# EAGLE design car4x4 (EAGLE 5.12)

## Sheet 1 of 3
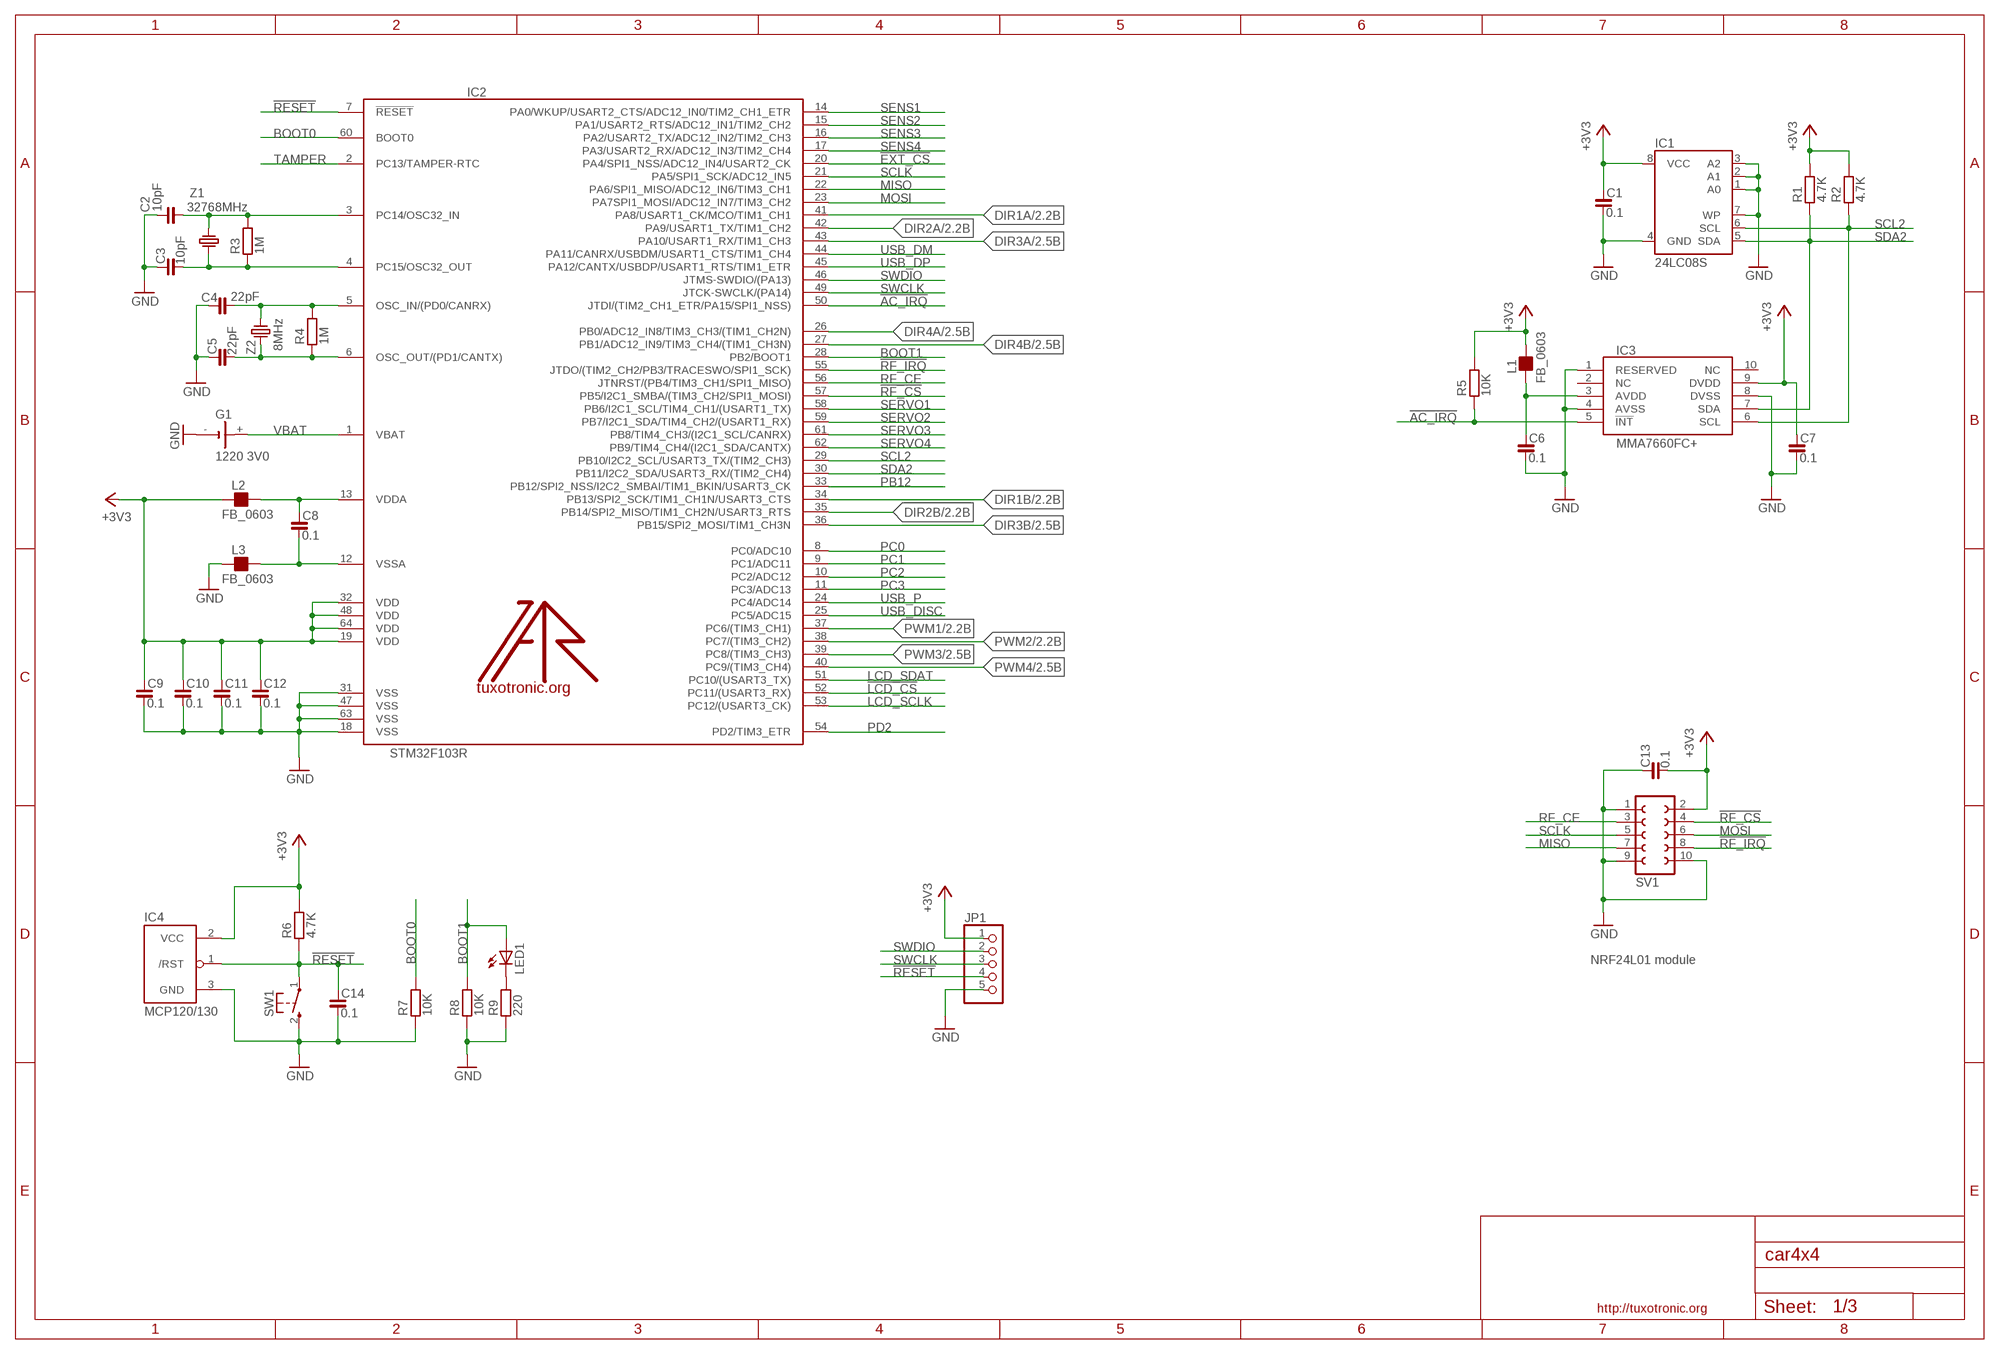
[diagram p0: schematic, sheet 1]

### Parts
C1  0.1  C_0603  [C0603]
C2  10pF  C_0603  [C0603]
C3  10pF  C_0603  [C0603]
C4  22pF  C_0603  [C0603]
C5  22pF  C_0603  [C0603]
C6  0.1  C_0603  [C0603]
C7  0.1  C_0603  [C0603]
C8  0.1  C_0603  [C0603]
C9  0.1  C_0603  [C0603]
C10  0.1  C_0603  [C0603]
C11  0.1  C_0603  [C0603]
C12  0.1  C_0603  [C0603]
C13  0.1  C_0603  [C0603]
C14  0.1  C_0603  [C0603]
G1  1220 3V0  1220SMT  [SMT1220]
IC1  24LC08S  AT24C256S  [SO08]
IC2  STM32F103R  [TQFP64]
IC3  MMA7660FC+  [DFN10]
IC4  MCP120/130  [SOT23]
JP1  PINHD-1X5_2.00  [1X05M]
L1  FB_0603  [L0603]
L2  FB_0603  [L0603]
L3  FB_0603  [L0603]
LED1  LEDCHIPLED_0805  [CHIPLED_0805]
R1  4.7K  R_0603  [R0603]
R2  4.7K  R_0603  [R0603]
R3  1M  R_0603  [R0603]
R4  1M  R_0603  [R0603]
R5  10K  R_0603  [R0603]
R6  4.7K  R_0603  [R0603]
R7  10K  R_0603  [R0603]
R8  10K  R_0603  [R0603]
R9  220  R_0603  [R0603]
SV1  FE05-2  [FE05-2]
SW1  KSS-2EG4430  [KSS-2EG4430]
U$1  LOGO  [TT_LOGO]
Z1  32768MHz  CRYSTAL-TC26H  [TC26H]
Z2  8MHz  CRYSTAL-HC49S  [HC49/S]

### Nets
!AC_IRQ: IC2.50(JTDI/(TIM2_CH1_ETR/PA15/SPI1_NSS)) IC3.5(!INT) R5.1
!EXT_CS: IC2.20(PA4/SPI1_NSS/ADC12_IN4/USART2_CK) ; also sheet 3
!LCD_CS: IC2.52(PC11/(USART3_RX)) ; also sheet 3
!RESET: C14.1 IC2.7(!RESET) IC4.1(/RST) JP1.4 R6.1 SW1.1(P) ; also sheet 3
!RF_CS: IC2.57(PB5/I2C1_SMBA/(TIM3_CH2/SPI1_MOSI)) SV1.4 ; also sheet 3
!RF_IRQ: IC2.55(JTDO/(TIM2_CH2/PB3/TRACESWO/SPI1_SCK)) SV1.8 ; also sheet 3
+3V3: C1.1 C7.1 C9.1 C10.1 C11.1 C12.1 C13.2 IC1.8(VCC) IC2.19(VDD) IC2.32(VDD) IC2.48(VDD) IC2.64(VDD) IC3.9(DVDD) IC4.2(VCC) JP1.1 L1.2 L2.1 R1.2 R2.2 R5.2 R6.2 SV1.2 ; also sheet 3
BOOT0: IC2.60(BOOT0) R7.2
BOOT1: IC2.28(PB2/BOOT1) LED1.A R8.2
DIR1A: IC2.41(PA8/USART1_CK/MCO/TIM1_CH1) ; also sheet 2
DIR1B: IC2.34(PB13/SPI2_SCK/TIM1_CH1N/USART3_CTS) ; also sheet 2
DIR2A: IC2.42(PA9/USART1_TX/TIM1_CH2) ; also sheet 2
DIR2B: IC2.35(PB14/SPI2_MISO/TIM1_CH2N/USART3_RTS) ; also sheet 2
DIR3A: IC2.43(PA10/USART1_RX/TIM1_CH3) ; also sheet 2
DIR3B: IC2.36(PB15/SPI2_MOSI/TIM1_CH3N) ; also sheet 2
DIR4A: IC2.26(PB0/ADC12_IN8/TIM3_CH3/(TIM1_CH2N)) ; also sheet 2
DIR4B: IC2.27(PB1/ADC12_IN9/TIM3_CH4/(TIM1_CH3N)) ; also sheet 2
GND: C1.2 C2.1 C3.1 C4.1 C5.1 C6.2 C7.2 C9.2 C10.2 C11.2 C12.2 C13.1 C14.2 G1.- IC1.1(A0) IC1.2(A1) IC1.3(A2) IC1.4(GND) IC1.7(WP) IC2.18(VSS) IC2.31(VSS) IC2.47(VSS) IC2.63(VSS) IC3.1(RESERVED) IC3.4(AVSS) IC3.8(DVSS) IC4.3(GND) JP1.5 L3.1 R7.1 R8.1 R9.1 SV1.1 SV1.9 SV1.10 SW1.2(S) ; also sheet 2,3
LCD_SCLK: IC2.53(PC12/(USART3_CK)) ; also sheet 3
LCD_SDAT: IC2.51(PC10/(USART3_TX)) ; also sheet 3
MISO: IC2.22(PA6/SPI1_MISO/ADC12_IN6/TIM3_CH1) SV1.7 ; also sheet 3
MOSI: IC2.23(PA7SPI1_MOSI/ADC12_IN7/TIM3_CH2) SV1.6 ; also sheet 3
N$4: C3.2 IC2.4(PC15/OSC32_OUT) R3.1 Z1.1
N$5: C2.2 IC2.3(PC14/OSC32_IN) R3.2 Z1.2
N$7: C8.1 IC2.13(VDDA) L2.2
N$16: C4.2 IC2.5(OSC_IN/(PD0/CANRX)) R4.2 Z2.2
N$21: LED1.C R9.2
N$22: C8.2 IC2.12(VSSA) L3.2
N$23: C6.1 IC3.3(AVDD) L1.1
PB12: IC2.33(PB12/SPI2_NSS/I2C2_SMBAI/TIM1_BKIN/USART3_CK) ; also sheet 3
PC0: IC2.8(PC0/ADC10) ; also sheet 3
PC1: IC2.9(PC1/ADC11) ; also sheet 3
PC2: IC2.10(PC2/ADC12) ; also sheet 3
PC3: IC2.11(PC3/ADC13) ; also sheet 3
PD2: IC2.54(PD2/TIM3_ETR) ; also sheet 3
PWM1: IC2.37(PC6/(TIM3_CH1)) ; also sheet 2
PWM2: IC2.38(PC7/(TIM3_CH2)) ; also sheet 2
PWM3: IC2.39(PC8/(TIM3_CH3)) ; also sheet 2
PWM4: IC2.40(PC9/(TIM3_CH4)) ; also sheet 2
RF_CE: IC2.56(JTNRST/(PB4/TIM3_CH1/SPI1_MISO)) SV1.3 ; also sheet 3
SCL2: IC1.6(SCL) IC2.29(PB10/I2C2_SCL/USART3_TX/(TIM2_CH3)) IC3.6(SCL) R2.1 ; also sheet 3
SCLK: IC2.21(PA5/SPI1_SCK/ADC12_IN5) SV1.5 ; also sheet 3
SDA2: IC1.5(SDA) IC2.30(PB11/I2C2_SDA/USART3_RX/(TIM2_CH4)) IC3.7(SDA) R1.1 ; also sheet 3
SENS1: IC2.14(PA0/WKUP/USART2_CTS/ADC12_IN0/TIM2_CH1_ETR) ; also sheet 3
SENS2: IC2.15(PA1/USART2_RTS/ADC12_IN1/TIM2_CH2) ; also sheet 3
SENS3: IC2.16(PA2/USART2_TX/ADC12_IN2/TIM2_CH3) ; also sheet 3
SENS4: IC2.17(PA3/USART2_RX/ADC12_IN3/TIM2_CH4) ; also sheet 3
SERVO1: IC2.58(PB6/I2C1_SCL/TIM4_CH1/(USART1_TX)) ; also sheet 3
SERVO2: IC2.59(PB7/I2C1_SDA/TIM4_CH2/(USART1_RX)) ; also sheet 3
SERVO3: IC2.61(PB8/TIM4_CH3/(I2C1_SCL/CANRX)) ; also sheet 3
SERVO4: IC2.62(PB9/TIM4_CH4/(I2C1_SDA/CANTX)) ; also sheet 3
SWCLK: IC2.49(JTCK-SWCLK/(PA14)) JP1.3
SWDIO: IC2.46(JTMS-SWDIO/(PA13)) JP1.2
TAMPER: IC2.2(PC13/TAMPER-RTC) ; also sheet 3
USB_DISC: IC2.25(PC5/ADC15) ; also sheet 3
USB_DM: IC2.44(PA11/CANRX/USBDM/USART1_CTS/TIM1_CH4) ; also sheet 3
USB_DP: IC2.45(PA12/CANTX/USBDP/USART1_RTS/TIM1_ETR) ; also sheet 3
USB_P: IC2.24(PC4/ADC14) ; also sheet 3
VBAT: G1.+ IC2.1(VBAT)
XTAL2: C5.2 IC2.6(OSC_OUT/(PD1/CANTX)) R4.1 Z2.1
Unconnected: IC3.2(NC) IC3.10(NC)

### Notes on the sheet
- NRF24L01 module

## Sheet 2 of 3
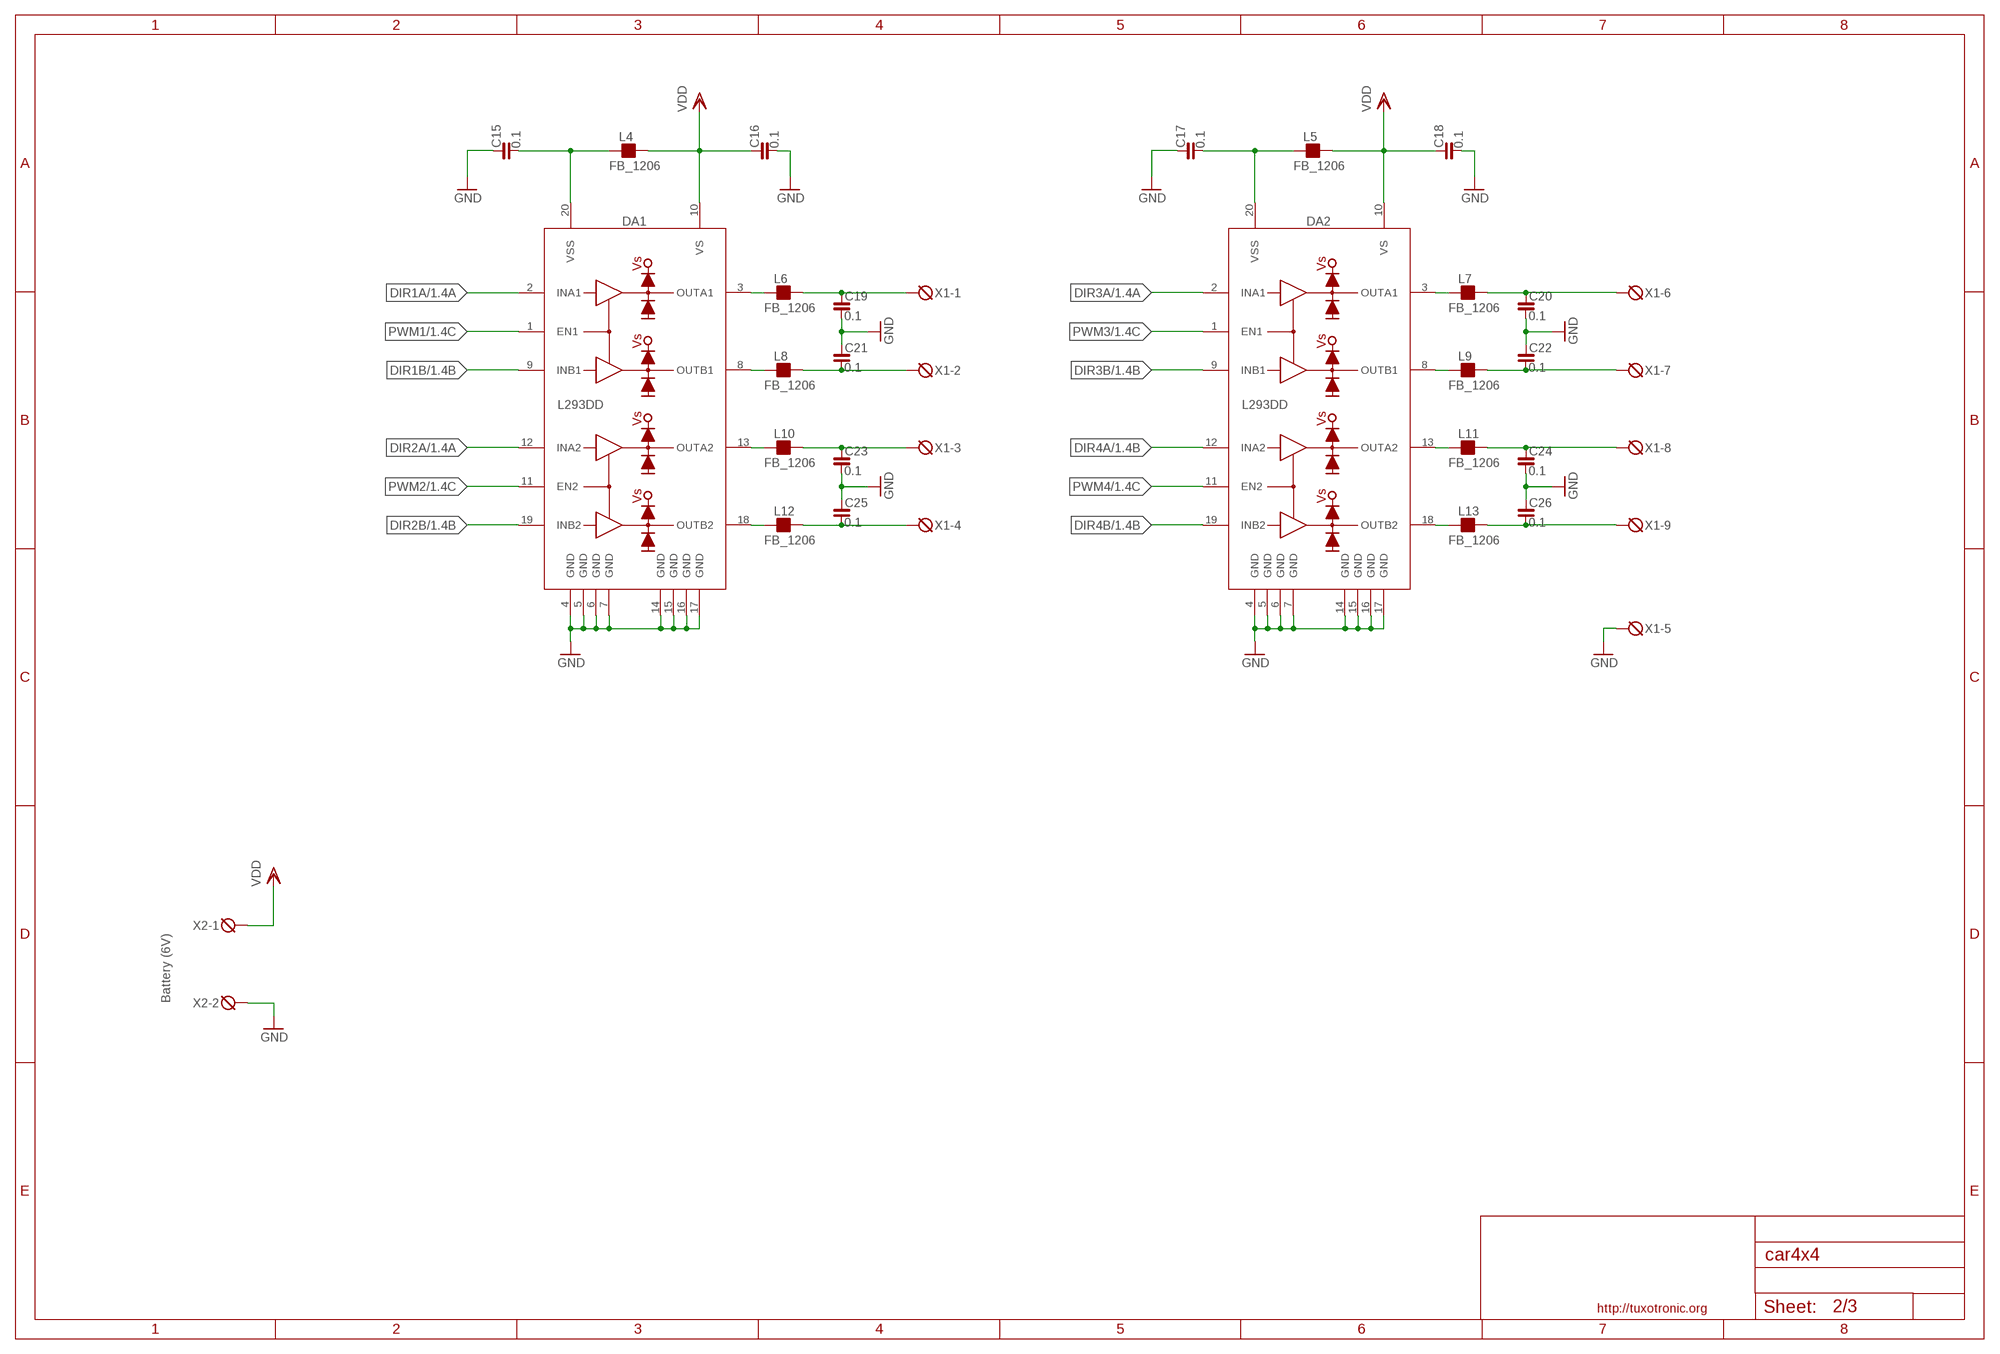
[diagram p1: schematic, sheet 2]

### Parts
C15  0.1  C_0603  [C0603]
C16  0.1  C_0603  [C0603]
C17  0.1  C_0603  [C0603]
C18  0.1  C_0603  [C0603]
C19  0.1  C_1206  [C1206]
C20  0.1  C_1206  [C1206]
C21  0.1  C_1206  [C1206]
C22  0.1  C_1206  [C1206]
C23  0.1  C_1206  [C1206]
C24  0.1  C_1206  [C1206]
C25  0.1  C_1206  [C1206]
C26  0.1  C_1206  [C1206]
DA1  L293DD  [POW-SO20L]
DA2  L293DD  [POW-SO20L]
L4  FB_1206  [L1206]
L5  FB_1206  [L1206]
L6  FB_1206  [L1206]
L7  FB_1206  [L1206]
L8  FB_1206  [L1206]
L9  FB_1206  [L1206]
L10  FB_1206  [L1206]
L11  FB_1206  [L1206]
L12  FB_1206  [L1206]
L13  FB_1206  [L1206]
X1  DG3XX-09-3.5  [DG350-3.5-09P]
X2  DG3XX-02-5.0  [DG306-5.0-02P]

### Nets
DIR1A: DA1.2(INA1) ; also sheet 1
DIR1B: DA1.9(INB1) ; also sheet 1
DIR2A: DA1.12(INA2) ; also sheet 1
DIR2B: DA1.19(INB2) ; also sheet 1
DIR3A: DA2.2(INA1) ; also sheet 1
DIR3B: DA2.9(INB1) ; also sheet 1
DIR4A: DA2.12(INA2) ; also sheet 1
DIR4B: DA2.19(INB2) ; also sheet 1
GND: C15.1 C16.2 C17.1 C18.2 C19.2 C20.2 C21.1 C22.1 C23.2 C24.2 C25.1 C26.1 DA1.4(GND) DA1.5(GND) DA1.6(GND) DA1.7(GND) DA1.14(GND) DA1.15(GND) DA1.16(GND) DA1.17(GND) DA2.4(GND) DA2.5(GND) DA2.6(GND) DA2.7(GND) DA2.14(GND) DA2.15(GND) DA2.16(GND) DA2.17(GND) X1.5 X2.2 ; also sheet 1,3
N$10: C15.2 DA1.20(VSS) L4.1
N$11: DA1.3(OUTA1) L6.1
N$12: DA1.8(OUTB1) L8.1
N$13: DA1.13(OUTA2) L10.1
N$14: DA1.18(OUTB2) L12.1
N$15: C17.2 DA2.20(VSS) L5.1
N$17: DA2.3(OUTA1) L7.1
N$18: DA2.8(OUTB1) L9.1
N$19: DA2.13(OUTA2) L11.1
N$20: DA2.18(OUTB2) L13.1
N$28: C19.1 L6.2 X1.1
N$29: C21.2 L8.2 X1.2
N$30: C23.1 L10.2 X1.3
N$31: C25.2 L12.2 X1.4
N$32: C20.1 L7.2 X1.6
N$33: C22.2 L9.2 X1.7
N$34: C24.1 L11.2 X1.8
N$35: C26.2 L13.2 X1.9
PWM1: DA1.1(EN1) ; also sheet 1
PWM2: DA1.11(EN2) ; also sheet 1
PWM3: DA2.1(EN1) ; also sheet 1
PWM4: DA2.11(EN2) ; also sheet 1
VDD: C16.1 C18.1 DA1.10(VS) DA2.10(VS) L4.2 L5.2 X2.1 ; also sheet 3

### Notes on the sheet
- Battery (6V)

## Sheet 3 of 3
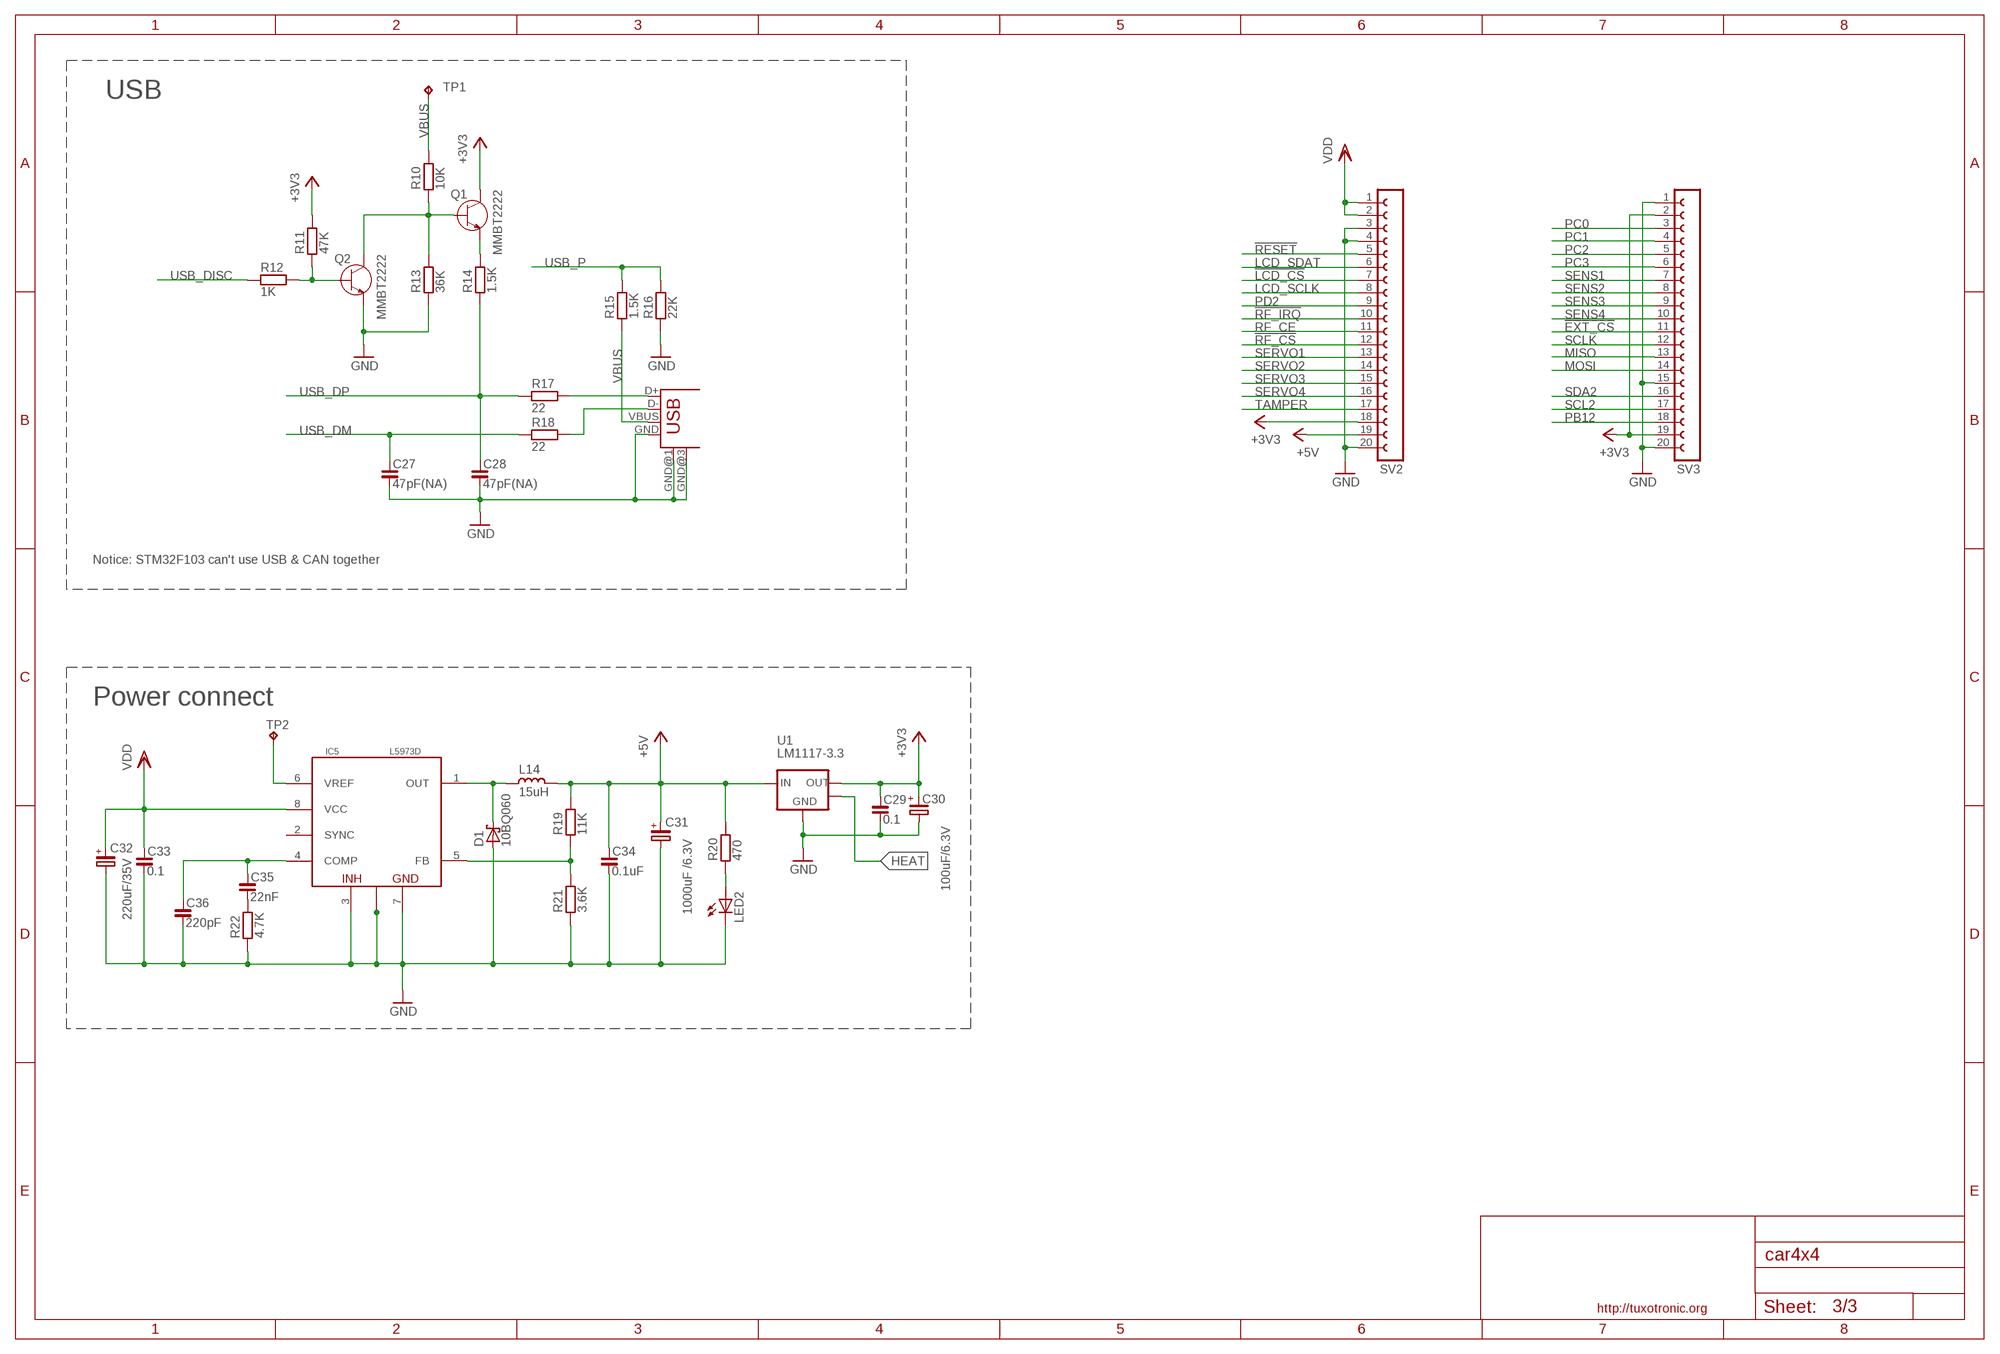
[diagram p2: schematic, sheet 3]

### Parts
C27  47pF(NA)  C_0603  [C0603]
C28  47pF(NA)  C_0603  [C0603]
C29  0.1  C_0603  [C0603]
C30  100uF/6.3V  CP_SMCC  [SMC_C]
C31  1000uF /6.3V  CP_E-035X080  [CE-035X080]
C32  220uF/35V  CP_E-035X080  [CE-035X080]
C33  0.1  C_0805  [C0805]
C34  0.1uF  C_0805  [C0805]
C35  22nF  C_0603  [C0603]
C36  220pF  C_0603  [C0603]
D1  10BQ060  SCHOTTKY-DIODESMD  [SMB]
IC5  L5973D  [HSOP8]
L14  15uH  L_CD75  [CD75]
LED2  LEDCHIPLED_0805  [CHIPLED_0805]
Q1  MMBT2222  [SOT23]
Q2  MMBT2222  [SOT23]
R10  10K  R_0603  [R0603]
R11  47K  R_0603  [R0603]
R12  1K  R_0603  [R0603]
R13  36K  R_0603  [R0603]
R14  1.5K  R_0603  [R0603]
R15  1.5K  R_0603  [R0603]
R16  22K  R_0603  [R0603]
R17  22  R_0603  [R0603]
R18  22  R_0603  [R0603]
R19  11K  R_0603  [R0603]
R20  470  R_0603  [R0603]
R21  3.6K  R_0603  [R0603]
R22  4.7K  R_0603  [R0603]
SV2  FE20-1  [FE20]
SV3  FE20-1  [FE20]
TP1  TPB1,27  [B1,27]
TP2  TPB1,27  [B1,27]
U1  LM1117-3.3  [SOT223]
USB1  USB-MB-S  [USB-MB-S]

### Nets
!EXT_CS: SV3.11 ; also sheet 1
!LCD_CS: SV2.7 ; also sheet 1
!RESET: SV2.5 ; also sheet 1
!RF_CS: SV2.12 ; also sheet 1
!RF_IRQ: SV2.10 ; also sheet 1
+3V3: C29.1 C30.+ Q1.3(C) R11.2 SV2.18 SV3.2 SV3.19 U1.2(OUT) ; also sheet 1
+5V: C31.+ C34.1 L14.1 R19.2 R20.2 SV2.19 U1.3(IN)
GND: C27.2 C28.2 C29.2 C30.- C31.- C32.- C33.2 C34.2 C36.2 D1.A IC5.3(INH) IC5.7(GND) IC5.H@1(GND1) IC5.H@2(GND2) IC5.H@3(GND3) IC5.H@4(GND4) IC5.H@5(GND5) IC5.H@6(GND6) LED2.C Q2.2(E) R13.1 R16.1 R21.1 R22.1 SV2.3 SV2.4 SV2.20 SV3.1 SV3.15 SV3.20 U1.1(GND) USB1.GND USB1.GND@1(GND) USB1.GND@3(GND) ; also sheet 1,2
HEAT: U1.4(MASS)
LCD_SCLK: SV2.8 ; also sheet 1
LCD_SDAT: SV2.6 ; also sheet 1
MISO: SV3.13 ; also sheet 1
MOSI: SV3.14 ; also sheet 1
N$36: Q1.2(E) R14.2
N$37: Q1.1(B) Q2.3(C) R10.1 R13.2
N$38: Q2.1(B) R11.1 R12.2
N$39: R17.2 USB1.D+
N$40: R18.2 USB1.D-
N$41: D1.C IC5.1(OUT) L14.2
N$42: IC5.5(FB) R19.1 R21.2
N$43: C35.2 R22.2
N$44: C35.1 C36.1 IC5.4(COMP)
N$45: IC5.6(VREF) TP2.PP(TP)
N$46: LED2.A R20.1
PB12: SV3.18 ; also sheet 1
PC0: SV3.3 ; also sheet 1
PC1: SV3.4 ; also sheet 1
PC2: SV3.5 ; also sheet 1
PC3: SV3.6 ; also sheet 1
PD2: SV2.9 ; also sheet 1
RF_CE: SV2.11 ; also sheet 1
SCL2: SV3.17 ; also sheet 1
SCLK: SV3.12 ; also sheet 1
SDA2: SV3.16 ; also sheet 1
SENS1: SV3.7 ; also sheet 1
SENS2: SV3.8 ; also sheet 1
SENS3: SV3.9 ; also sheet 1
SENS4: SV3.10 ; also sheet 1
SERVO1: SV2.13 ; also sheet 1
SERVO2: SV2.14 ; also sheet 1
SERVO3: SV2.15 ; also sheet 1
SERVO4: SV2.16 ; also sheet 1
TAMPER: SV2.17 ; also sheet 1
USB_DISC: R12.1 ; also sheet 1
USB_DM: C27.1 R18.1 ; also sheet 1
USB_DP: C28.1 R14.1 R17.1 ; also sheet 1
USB_P: R15.2 R16.2 ; also sheet 1
VBUS: R10.2 R15.1 TP1.PP(TP) USB1.VBUS
VDD: C32.+ C33.1 IC5.8(VCC) SV2.1 SV2.2 ; also sheet 2
Unconnected: IC5.2(SYNC)

### Notes on the sheet
- USB
- Notice: STM32F103 can't use USB & CAN together
- Power connect

## Library data of the parts
C1-C29 C33-C36 = rc-master-smd:C_: NON-POLARIZED CAP
C30 = rc-master-smd:CP_: POLARIZED CAP
C31 C32 = rc-master:CP_: POLARIZED CAP
D1 = main:SCHOTTKY-DIODE: Schottky Diode
DA1 DA2 = h-bridge:L293DD: Push-pull four channel driver with diodes.
G1 = battery:1220SMT
IC1 = stm32-by-pb:AT24C*: 2-wire serial EEPROM
IC2 = stm32:STM32F103R: Medium-density performance line ARM-based 32-bit MCU with 64 or 128 KB Flash, USB, CAN, 7 timers, 2 ADCs, 9 communication interfaces
IC3 = accelerometer:MMA7660FC: 3-Axis Orientation/Motion Detection Sensor Features Digital Output (I2C) 3mm x 3mm x 0.9mm DFN Package Low Power Current Consumption: Off Mode: 0.4 ?A, Standby Mode: 2 ?A, Active Mode: 47 ?A at 1 ODR Configurable Samples per Second from 1 to 120 samples a second. Low Voltage Operation: ? Analog Voltage: 2.4 V - 3.6 V ? Digital Voltage: 1.71 V - 3.6 V Auto-Wake/Sleep Feature for Low Power Consumption Tilt Orientation Detection for Portrait/Landscape Capability Gesture Detection Including Shake Detection and Tap
IC4 = mcp120-130:MCP120/130
IC5 = vreg-pulse:L5973: 2A SWITCH STEP DOWN SWITCHING REGULATOR
JP1 = pinhead-fixdrills:PINHD-1X5: PIN HEADER
L1-L13 = rc-master-smd:FB_: FERRITE BEAD
L14 = rc-master-smd:L_: INDUCTOR
LED1 LED2 = led:LED: LED OSRAM: - CHIPLED LG R971, LG N971, LY N971, LG Q971, LY Q971, LO R971, LY R971 LH N974, LH R974 LS Q976, LO Q976, LY Q976 LO Q996 - Hyper CHIPLED LW Q18S LB Q993, LB Q99A, LB R99A - SideLED LS A670, LO A670, LY A670, LG A670, LP A670 LB A673, LV A673, LT A673, LW A673 LH A674 LY A675 LS A676, LA A676, LO A676, LY A676, LW A676 LS A679, LY A679, LG A679 - Hyper Micro SIDELED® LS Y876, LA Y876, LO Y876, LY Y876 LT Y87S - SmartLED LW L88C, LW L88S LB L89C, LB L89S, LG L890 LS L89K, LO L89K, LY L89K LS L896, LA L896, LO L896, LY L896 - TOPLED LS T670, LO T670, LY T670, LG T670, LP T670 LSG T670, LSP T670, LSY T670, LOP T670, LYG T670 LG T671, LOG T671, LSG T671 LB T673, LV T673, LT T673, LW T673 LH T674 LS T676, LA T676, LO T676, LY T676, LB T676, LH T676, LSB T676, LW T676 LB T67C, LV T67C, LT T67C, LS T67K, LO T67K, LY T67K, LW E67C LS E67B, LA E67B, LO E67B, LY E67B, LB E67C, LV E67C, LT E67C LW T67C LS T679, LY T679, LG T679 LS T770, LO T770, LY T770, LG T770, LP T770 LB T773, LV T773, LT T773, LW T773 LH T774 LS E675, LA E675, LY E675, LS T675 LS T776, LA T776, LO T776, LY T776, LB T776 LHGB T686 LT T68C, LB T68C - Hyper Mini TOPLED® LB M676 - Mini TOPLED Santana® LG M470 LS M47K, LO M47K, LY M47K Source: http://www.osram.convergy.de - LUMILED® LXK2-PW12-R00, LXK2-PW12-S00, LXK2-PW14-U00, LXK2-PW14-V00 LXK2-PM12-R00, LXK2-PM12-S00, LXK2-PM14-U00 LXK2-PE12-Q00, LXK2-PE12-R00, LXK2-PE12-S00, LXK2-PE14-T00, LXK2-PE14-U00 LXK2-PB12-K00, LXK2-PB12-L00, LXK2-PB12-M00, LXK2-PB14-N00, LXK2-PB14-P00, LXK2-PB14-Q00 LXK2-PR12-L00, LXK2-PR12-M00, LXK2-PR14-Q00, LXK2-PR14-R00 LXK2-PD12-Q00, LXK2-PD12-R00, LXK2-PD12-S00 LXK2-PH12-R00, LXK2-PH12-S00 LXK2-PL12-P00, LXK2-PL12-Q00, LXK2-PL12-R00 Source: www.luxeon.com
Q1 Q2 = semiconductor:MMBT2222: General Purpose Transistors NPN Silicon Rating MMBT2222LT1G MMBT2222ALT1G Collector-Emitter Voltage (VCEO) 30 Vdc 40 Vdc Collector-Base Voltage (VCBO) 60 Vdc 75 Vdc Emitter-Base Voltage (VEBO) 5.0 Vdc 6.0 Vdc Collector Current Continuous (IC) 600 mAdc 1100 mAdc Collector Current Peak (ICM) 600 mAdc 1100 mAdc
R1-R22 = rc-master-smd:R_: RESISTOR
SV1 = con-lsta:FE05-2: FEMALE HEADER
SV2 SV3 = con-lsta:FE20-1: FEMALE HEADER
SW1 = buttons:KSS-2EG4430: Size: 3x6mm Height: 5mm from PCB Rating: DC12v 50mA Travel: 0.25±0.10mm Operating Force: 180±50gf Return Force: 60gf min Contact resistance: 100m? max Insulation resistance: 100M? min Operating life?50,000 cycles
TP1 TP2 = testpad:TP: Test pad
U1 = vreg-linear:LM1117: Linear regulators
U$1 = logo:LOGO
USB1 = usb:USB: USB Connectors
X1 = degson:DG3XX-09: DG350-3.5-09P DG306-5.0-09P
X2 = degson:DG3XX-02: DG350-3.5-02P DG306-5.0-02P
Z1 Z2 = discrete:CRYSTAL-: CRYSTAL

## Board
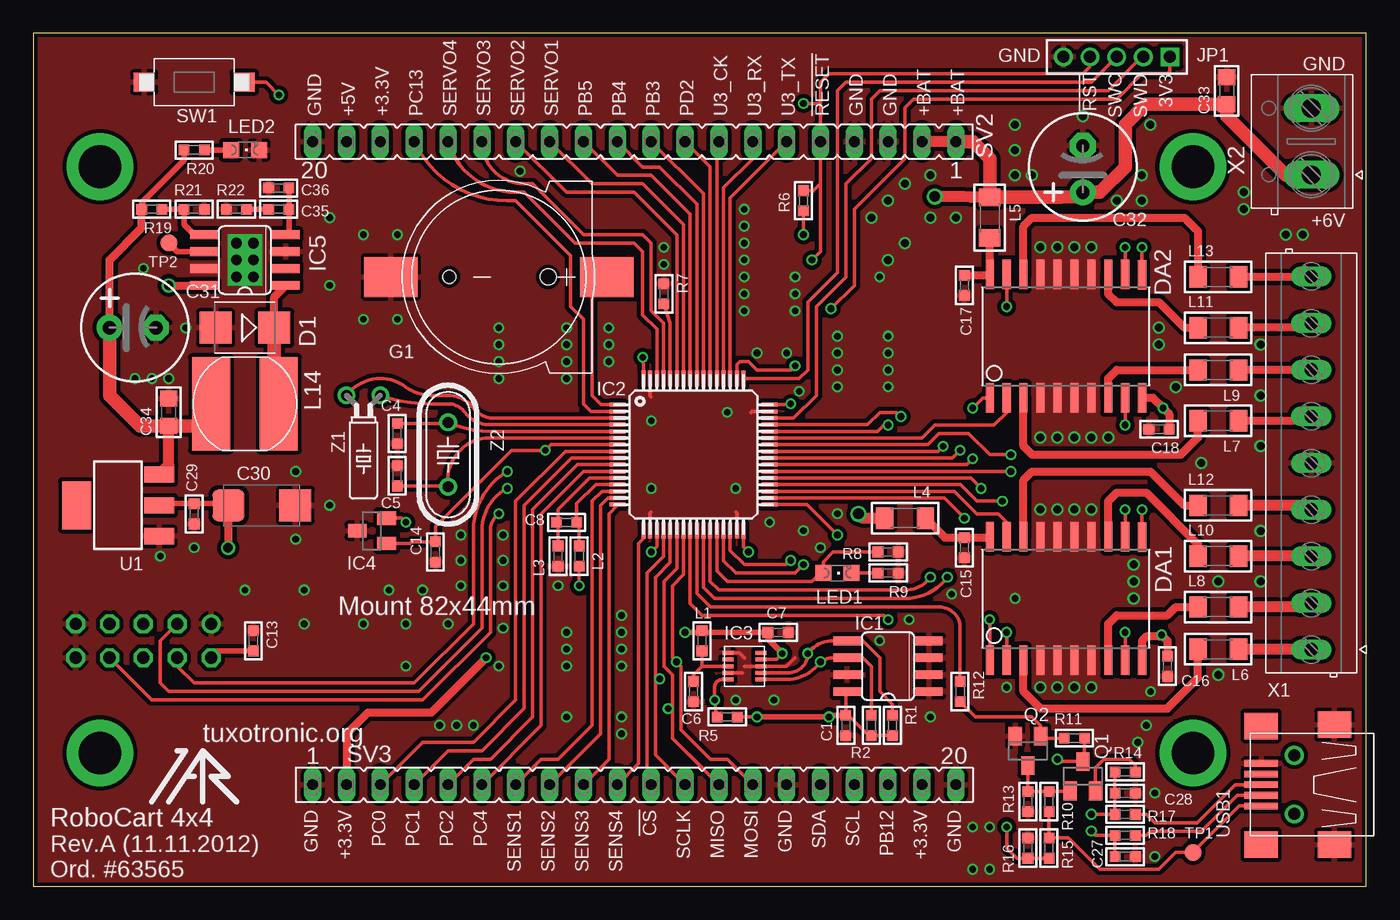
[diagram p3: board, top side]
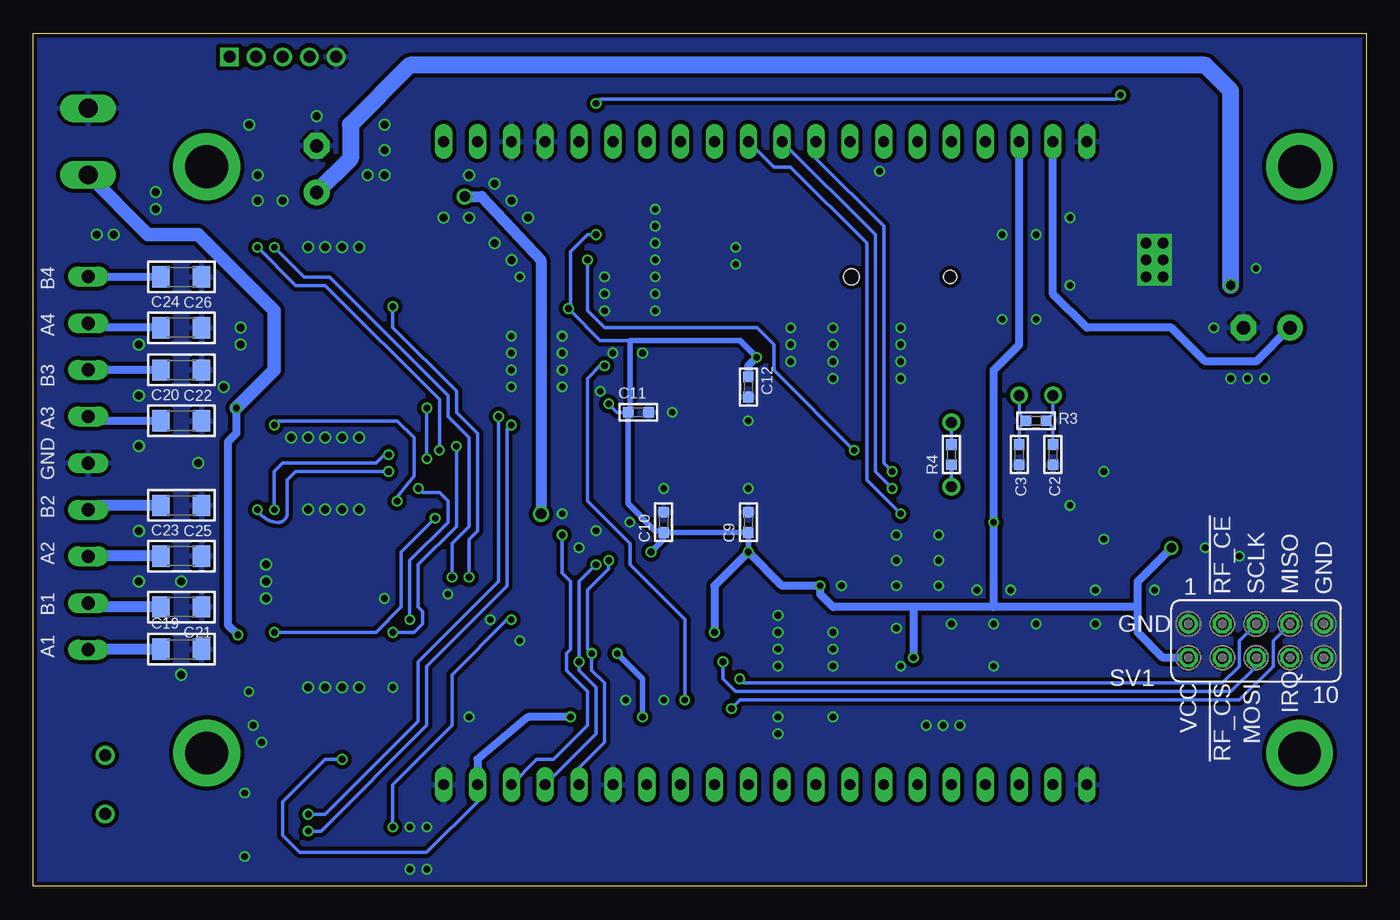
[diagram p4: board, bottom side, seen from below]

Size 100 x 64 mm. Coordinates in mm from the lower left corner, seen from the top.
Outline: 0,0 100,0 100,64 0,64 0,0
Copper layers (1*16): Top 0.035mm / dielectric 1.5mm / Bottom 0.035mm
Design rules "Fusion_eagle_rule_v1.1": minimum track width 6mil, minimum drill 12mil, track to track 6mil, track to pad 6mil, pad to pad 6mil, via to via 6mil, smd to smd 0mil, copper to edge 10mil, drill to drill 10mil, minimum pad ring 10mil, minimum via ring 6mil, stop-mask expansion 2mil, vias tented up to drill 100mil, thermal gap 10mil

### Footprints (pad centres in the part's own frame; a part is rotated, then mirrored left to right if it is on the bottom)
C0603 = smd 0.8 x 0.8: 1 -0.762,0; 2 0.762,0
C1206 = smd 1.3 x 1.6: 1 -1.524,0; 2 1.524,0
SMC_C = smd 2.4 x 2.4: + -2.5,0; - 2.5,0
CE-035X080 = drill 1 pad 1.93 round: + -1.905,0 | drill 1 pad 1.93 octagon: - 1.587,0
C0805 = smd 1.2 x 1.3: 1 -1.016,0; 2 1.016,0
SMB = smd 2.4 x 2.4: A 2.2,0; C -2.2,0
POW-SO20L = smd 0.61 x 2.21: 1 -5.715,-4.636; 2 -4.445,-4.636; 3 -3.175,-4.636; 4 -1.905,-4.636; 5 -0.635,-4.636; 6 0.635,-4.636; 7 1.905,-4.636; 8 3.175,-4.636; 9 4.445,-4.636; 10 5.715,-4.636; 11 5.715,4.61; 12 4.445,4.636; 13 3.175,4.636; 14 1.905,4.636; 15 0.635,4.636; 16 -0.635,4.636; 17 -1.905,4.636; 18 -3.175,4.636; 19 -4.445,4.636; 20 -5.715,4.636
SMT1220 = smd 4 x 3: + -8.1,0; - 8.1,0 | hole 1: 3.7,0 | hole 1.2: -3.7,0
SO08 = smd 0.66 x 2.032: 1 -1.905,-3.073; 2 -0.635,-3.073; 3 0.635,-3.073; 4 1.905,-3.073; 5 1.905,3.073; 6 0.635,3.073; 7 -0.635,3.073; 8 -1.905,3.073
TQFP64 = smd 1.2 x 0.3: 1 -5.7,3.75; 2 -5.7,3.25; 3 -5.7,2.75; 4 -5.7,2.25; 5 -5.7,1.75; 6 -5.7,1.25; 7 -5.7,0.75; 8 -5.7,0.25; 9 -5.7,-0.25; 10 -5.7,-0.75; 11 -5.7,-1.25; 12 -5.7,-1.75; 13 -5.7,-2.25; 14 -5.7,-2.75; 15 -5.7,-3.25; 16 -5.7,-3.75; 33 5.7,-3.75; 34 5.7,-3.25; 35 5.7,-2.75; 36 5.7,-2.25; 37 5.7,-1.75; 38 5.7,-1.25; 39 5.7,-0.75; 40 5.7,-0.25; 41 5.7,0.25; 42 5.7,0.75; 43 5.7,1.25; 44 5.7,1.75; 45 5.7,2.25; 46 5.7,2.75; 47 5.7,3.25; 48 5.7,3.75 | smd 0.3 x 1.2: 17 -3.75,-5.7; 18 -3.25,-5.7; 19 -2.75,-5.7; 20 -2.25,-5.7; 21 -1.75,-5.7; 22 -1.25,-5.7; 23 -0.75,-5.7; 24 -0.25,-5.7; 25 0.25,-5.7; 26 0.75,-5.7; 27 1.25,-5.7; 28 1.75,-5.7; 29 2.25,-5.7; 30 2.75,-5.7; 31 3.25,-5.7; 32 3.75,-5.7; 49 3.75,5.7; 50 3.25,5.7; 51 2.75,5.7; 52 2.25,5.7; 53 1.75,5.7; 54 1.25,5.7; 55 0.75,5.7; 56 0.25,5.7; 57 -0.25,5.7; 58 -0.75,5.7; 59 -1.25,5.7; 60 -1.75,5.7; 61 -2.25,5.7; 62 -2.75,5.7; 63 -3.25,5.7; 64 -3.75,5.7
DFN10 = smd 0.3 x 0.825: 1 -1,-1.24; 2 -0.5,-1.24; 3 0,-1.24; 4 0.5,-1.24; 5 1,-1.24; 6 1,1.24; 7 0.5,1.24; 8 0,1.24; 9 -0.5,1.24; 10 -1,1.24
SOT23 = smd 1 x 1.4: 1 -0.95,-1.1; 2 0.95,-1.1; 3 0,1.1
HSOP8 = smd 0.66 x 2.032: 1 -1.905,-3.073; 2 -0.635,-3.073; 3 0.635,-3.073; 4 1.905,-3.073; 5 1.905,3.073; 6 0.635,3.073; 7 -0.635,3.073; 8 -1.905,3.073 | drill 0.8 square: H@1 -1.27,-0.635; H@2 0,-0.635; H@3 1.27,-0.635; H@4 1.27,0.635; H@5 0,0.635; H@6 -1.27,0.635
1X05M = drill 0.9 square: 1 -4,0 | drill 0.9 round: 2 -2,0; 3 0,0; 4 2,0; 5 4,0
L0603 = smd 0.8 x 0.8: 1 -0.762,0; 2 0.762,0
L1206 = smd 1.3 x 1.6: 1 -1.524,0; 2 1.524,0
CD75 = smd 7 x 2.85: 1 0,2.54; 2 0,-2.54
CHIPLED_0805 = smd 1.2 x 1.2: A 0,-1.05; C 0,1.05
R0603 = smd 0.8 x 0.8: 1 -0.762,0; 2 0.762,0
FE05-2 = drill 0.914 round: 1 -5.08,1.27 | drill 0.914 octagon: 2 -5.08,-1.27; 3 -2.54,1.27; 4 -2.54,-1.27; 5 0,1.27; 6 0,-1.27; 7 2.54,1.27; 8 2.54,-1.27; 9 5.08,1.27; 10 5.08,-1.27
FE20 = drill 0.813 long: 1 -24.13,0; 2 -21.59,0; 3 -19.05,0; 4 -16.51,0; 5 -13.97,0; 6 -11.43,0; 7 -8.89,0; 8 -6.35,0; 9 -3.81,0; 10 -1.27,0; 11 1.27,0; 12 3.81,0; 13 6.35,0; 14 8.89,0; 15 11.43,0; 16 13.97,0; 17 16.51,0; 18 19.05,0; 19 21.59,0; 20 24.13,0
KSS-2EG4430 = smd 1.6 x 1.4: 1 -3.75,0; 2 3.75,0
B1,27 = smd 1.27 x 1.27: PP 0,0
SOT223 = smd 1.219 x 2.235: 1 -2.311,-3.099; 2 0,-3.099; 3 2.311,-3.099 | smd 3.6 x 2.2: 4 0,3.099
USB-MB-S = smd 2.5 x 0.5: D+ 2.5,0; D- 2.5,0.8; GND 2.5,-1.6; ID 2.5,-0.8; VBUS 2.5,1.6 | smd 2.5 x 2: GND@1 -3,4.5; GND@2 2.5,4.5; GND@3 -3,-4.5; GND@4 2.5,-4.4 | drill 0.9 round: P$5 0,2.2; P$6 0,-2.2
DG350-3.5-09P = drill 1 long: 1 -14,0; 2 -10.5,0; 3 -7,0; 4 -3.5,0; 5 0,0; 6 3.5,0; 7 7,0; 8 10.5,0; 9 14,0
DG306-5.0-02P = drill 1.4 long: 1 -2.5,0; 2 2.5,0
TC26H = drill 0.813 round: 1 -1.27,0; 2 1.27,0
HC49/S = drill 0.813 round: 1 -2.413,0; 2 2.413,0

### Placement (x,y rotation side)
C1  60.96,12.06 270 top
C2  23.5,32.38 90 bottom
C3  26.04,32.38 90 bottom
C4  27.3,33.97 90 top
C5  27.3,30.8 270 top
C6  49.53,14.61 270 top
C7  55.88,19.05 0 top
C8  40.01,27.3 180 top
C9  46.35,27.3 90 bottom
C10  52.7,27.3 90 bottom
C11  54.61,35.56 0 bottom
C12  46.35,37.47 270 bottom
C13  16.51,18.41 270 top
C14  30.16,25.08 270 top
C15  69.85,25.4 90 top
C16  85.09,16.51 270 top
C17  69.85,45.09 90 top
C18  84.45,34.29 180 top
C19  88.9,17.78 0 bottom
C20  88.9,34.92 0 bottom
C21  88.9,20.95 180 bottom
C22  88.9,38.73 180 bottom
C23  88.9,24.77 0 bottom
C24  88.9,41.91 0 bottom
C25  88.9,28.57 180 bottom
C26  88.9,45.72 180 bottom
C27  81.92,2.22 0 top
C28  81.92,6.99 0 top
C29  12.06,27.94 270 top
C30  17.14,28.57 0 top
C31  7.62,41.91 0 top
C32  78.74,53.98 90 top
C33  89.53,59.69 90 top
C34  10.16,35.56 90 top
C35  18.41,50.8 180 top
C36  18.41,52.39 180 top
D1  15.88,41.91 180 top
DA1  77.47,21.59 0 top
DA2  77.47,41.27 0 top
G1  34.92,45.72 180 top
IC1  64.14,16.51 90 top
IC2  49.53,32.38 0 top
IC3  53.34,16.51 270 top
IC4  25.4,26.67 90 top
IC5  15.88,46.99 90 top
JP1  81.28,62.23 180 top
L1  50.16,18.41 90 top
L2  40.96,24.77 90 top
L3  39.37,24.77 90 top
L4  65.41,27.62 180 top
L5  71.75,50.16 90 top
L6  88.9,17.78 0 top
L7  88.9,34.92 0 top
L8  88.9,20.95 0 top
L9  88.9,38.73 0 top
L10  88.9,24.77 0 top
L11  88.9,41.91 0 top
L12  88.9,28.57 0 top
L13  88.9,45.72 0 top
L14  15.88,36.2 90 top
LED1  60.33,23.5 270 top
LED2  15.88,55.24 270 top
Q1  78.74,8.26 0 top
Q2  74.61,10.16 180 top
R1  64.45,12.06 270 top
R2  62.87,12.06 270 top
R3  24.77,34.92 0 bottom
R4  31.11,32.38 90 bottom
R5  52.07,12.7 0 top
R6  57.78,51.44 270 top
R7  47.31,44.45 270 top
R8  64.14,25.08 180 top
R9  64.14,23.5 180 top
R10  76.2,6.35 270 top
R11  78.11,11.11 0 top
R12  69.53,14.61 270 top
R13  74.61,6.35 90 top
R14  81.92,8.57 0 top
R15  76.2,2.86 270 top
R16  74.61,2.86 270 top
R17  81.92,5.4 0 top
R18  81.92,3.81 0 top
R19  8.89,50.8 180 top
R20  12.06,55.24 180 top
R21  12.06,50.8 180 top
R22  15.24,50.8 0 top
SV1  8.26,18.41 0 bottom
SV2  45.09,55.88 180 top
SV3  45.09,7.62 0 top
SW1  12.06,60.33 180 top
TP1  87,2.54 0 top
TP2  10.16,48.26 180 top
U1  6.35,28.57 90 top
U$1  12.7,8.89 0 top
USB1  94.61,7.62 180 top
X1  95.89,31.75 90 top
X2  95.89,55.88 90 top
Z1  24.77,36.83 180 top
Z2  31.11,32.38 90 top

### Tracks (layer width: path | path; a pad name or v marks a point on that pad's centre or on a via)
!AC_IRQ  (via drill 0.5)
  Top 0.254: IC2.50 52.78,39.13 53.02,39.37 53.66,39.37 54.29,38.73 56.83,38.73 v57.15,39.05 | IC3.5 51.7,15.51 arc90 51.12,14.92 v51.12,13.97 arc17 R5.1
  Bottom 0.254: v57.15,39.05 57.47,39.05 58.42,38.1 58.42,28.89 55.24,25.72 55.24,24.13 51.12,20 v51.12,13.97
!EXT_CS
  Top 0.254: IC2.20 47.28,24.74 46.04,23.5 46.04,7.94 SV3.11
!LCD_CS
  Top 0.254: IC2.52 51.78,52.41 53.98,54.61 SV2.7
!RESET  (via drill 0.5)
  Top 0.254: 59.05,58.74 SV2.5 59.05,52.7 | IC2.7 38.85,33.13 v38.42,32.7 35.88,32.7 30.16,26.99 C14.1 28.38,25.84 28.26,25.72 IC4.1 | v58.42,46.99 59.05,47.62 59.05,52.7 | SW1.1 17.46,60.33 v18.41,59.37 | 59.05,58.74 v57.78,58.74 | JP1.4 79.28,61.5 78.74,60.96 59.69,60.96 59.05,60.33 59.05,58.74 | R6.1 58.55,52.2 59.05,52.7
  Bottom 0.254: v38.42,32.7 44.45,38.73 44.45,40.64 45.72,41.91 57.15,41.91 58.42,43.18 v58.42,46.99 | v18.41,59.37 18.73,59.05 57.47,59.05 v57.78,58.74
!RF_CS  (via drill 0.5)
  Top 0.254: IC2.57 49.28,50.41 46.35,53.34 43.81,53.34 SV2.12 | SV1.4 10.79,16.51 12.06,15.24 28.57,15.24 33.02,19.68 33.02,26.67 arc-59 v35.56,31.11
  Bottom 0.254: v35.56,31.11 36.2,31.75 36.2,49.53 41.27,54.61 SV2.12
!RF_IRQ  (via drill 0.5)
  Top 0.254: IC2.55 50.28,51.95 SV2.10 | SV1.8 8.89,13.97 29.21,13.97 34.29,19.05 34.29,26.67 arc-53 v34.92,27.94
  Bottom 0.254: v34.92,27.94 37.47,30.48 37.47,48.26 43.18,53.98 44.45,53.98 SV2.10
+3V3  (via drill 0.5, 0.7)
  Top 0.254: R1.2 R2.2 62.67,11.3 61.15,12.83 C1.1 60.96,14.5 IC1.8 | 55.88,17.14 v56.2,17.46 55.74,17.01 IC3.9 | IC2.32 53.28,25.46 v53.66,25.08 | IC2.19 46.78,25.51 v46.35,25.08 | IC2.64 45.78,39.11 v45.72,39.69 | IC2.48 56.77,36.13 v56.83,36.2 | 50.04,19.05 L1.2 | v40.96,22.54 L2.1 | IC4.2 27.62,27.62 v27.94,27.3 | v54.29,12.7 R5.2 | R11.2 78.87,9.48 Q1.3 77,9.36 v76.83,9.53 | JP1.1 85.28,61.15 85.09,60.96 83.19,60.96 81.28,59.05 66.04,59.05 65.41,58.42 65.41,54.61 61.59,50.8 61.59,45.09 v59.85,43.34 | v57.78,48.9 R6.2
  Top 0.406: C13.2 13.84,17.65 SV1.2 | v56.2,17.46 55.12,18.54 C7.1 50.29,19.05 L1.2 | v48.9,19.05 50.04,19.05 | v54.29,12.7 v59.69,12.7 59.82,12.83 C1.1 | U1.2 9.58,28.7 C29.1 14.52,28.7 C30.+
  Top 0.61: C30.+ 14.64,25.44 v14.61,25.4 | SV3.2 23.5,11.43 25.08,13.02 29.84,13.02 v33.97,17.14
  Bottom 0.254: C11.1 56.2,35.56 v56.83,36.2 | 55.24,40.96 57.47,40.96 59.69,43.18 | v76.83,9.53 78.11,9.53 81.28,6.35 81.28,3.81 80.01,2.54 70.48,2.54 66.67,6.35 SV3.19 | v57.78,48.9 58.42,48.9 59.69,47.62 59.69,43.18 | 59.69,43.18 v59.85,43.34
  Bottom 0.406: v45.72,39.69 46.99,40.96 55.24,40.96 55.24,35.69 C11.1 55.37,28.7 53.34,26.67 52.83,26.67 C10.1 | C10.1 C9.1 v46.35,25.08 | v54.29,12.7 54.29,15.56 v56.2,17.46 | C10.1 52.7,26.04 v53.66,25.08
  Bottom 0.61: SV3.19 66.67,9.53 62.87,12.7 v59.69,12.7 | 17.14,20.95 17.14,22.86 v14.61,25.4 | SV1.2 15.24,17.14 17.14,19.05 17.14,20.95 | 17.14,20.95 27.94,20.95 | 27.94,20.95 33.97,20.95 | 33.97,20.95 40.01,20.95 40.96,21.91 v40.96,22.54 43.81,22.54 v46.35,25.08 48.9,22.54 v48.9,19.05 | SV2.18 26.04,40.64 27.94,38.73 v27.94,27.3 27.94,20.95 | C12.1 46.35,39.05 v45.72,39.69 | 33.97,20.95 v33.97,17.14
+5V
  Top 0.406: R19.2 8.13,51.31 11.3,54.48 R20.2
  Top 0.61: R19.2 8.13,49.4 5.71,46.99 C31.+
  Top 0.813: C34.1 10.16,31.6 U1.3
  Top 1.016: L14.1 12.32,34.54 C34.1 8,34.54 5.71,36.83 C31.+
  Bottom 0.61: SV2.19 23.5,44.45 20.95,41.91 14.61,41.91 12.06,39.37 8.26,39.37 C31.+
BOOT0
  Top 0.254: IC2.60 47.78,42.26 R7.2
BOOT1
  Top 0.254: IC2.28 51.28,23.65 52.07,22.86 58.42,22.86 59.05,23.5 LED1.A 59.27,24.35 60.01,25.08 R8.2
DIR1A  (via drill 0.5)
  Top 0.254: v73.03,19.05 DA1.2 | IC2.41 67.88,32.63 v68.26,33.02
  Bottom 0.254: v68.26,33.02 68.26,26.99 71.12,24.13 71.12,20.95 70.8,20.64 70.8,19.68 71.44,19.05 v73.03,19.05
DIR1B  (via drill 0.5)
  Top 0.254: IC2.34 68.34,29.14 v69.85,27.62 | v81.92,19.05 DA1.9
  Bottom 0.254: v69.85,27.62 72.39,25.08 72.39,20.95 74.3,19.05 v81.92,19.05
DIR2A  (via drill 0.5)
  Top 0.254: v81.92,28.26 DA1.12 | IC2.42 67.11,33.13 67.94,33.97 70.17,33.97 71.75,32.38 v73.34,32.38
  Bottom 0.254: v73.34,32.38 73.66,32.38 74.3,31.75 81.28,31.75 81.92,31.11 v81.92,28.26
DIR2B
  Top 0.254: IC2.35 69.11,29.64 70.8,27.94 72.39,27.94 73.03,27.3 DA1.19
DIR3A
  Top 0.254: IC2.43 66.66,33.63 67.63,34.61 72.07,34.61 73.03,35.56 DA2.2
DIR3B  (via drill 0.5)
  Top 0.254: IC2.36 69.56,30.14 70.8,28.89 v72.71,28.89 | v81.92,34.61 DA2.9
  Bottom 0.254: v72.71,28.89 72.71,29.21 71.44,30.8 71.44,33.66 72.71,34.92 81.6,34.92 v81.92,34.61
DIR4A  (via drill 0.5)
  Top 0.254: IC2.26 50.28,22.43 51.12,21.59 65.41,21.59 arc53 v68.58,23.18 | v81.92,47.94 DA2.12
  Bottom 0.254: v68.58,23.18 68.58,25.72 67.31,26.99 67.31,33.66 68.9,35.24 68.9,36.83 77.79,45.72 79.69,45.72 v81.92,47.94
DIR4B  (via drill 0.5)
  Top 0.254: IC2.27 50.78,22.88 51.44,22.23 65.41,22.23 arc53 v67.31,23.18 | v73.03,43.5 DA2.19
  Bottom 0.254: v67.31,23.18 67.31,26.04 66.67,26.67 66.67,33.97 68.26,35.56 68.26,37.15 73.03,41.91 v73.03,43.5
GND  (via drill 0.5, 0.6)
  Top 0.254: IC3.4 53.2,16.01 | IC3.1 52.98,17.51 53.34,17.14 | 53.34,16.51 IC3.8 56.52,16.51 57.15,17.14 | IC2.47 53.92,35.63 C11.2 | IC2.63 46.28,36.78 C12.2 | IC2.31 52.78,27.99 C10.2 | IC2.18 46.28,27.99 C9.2
  other vias: 75.56,33.66 76.83,33.66 78.11,33.66 79.38,33.66 80.64,33.66 75.56,47.94 76.83,47.94 78.11,47.94 79.38,47.94 75.56,28.26 76.83,28.26 78.11,28.26 79.38,28.26 75.56,14.92 76.83,14.92 78.11,14.92 79.38,14.92 46.35,29.84 52.7,29.84 46.35,34.92 52.07,35.56 83.19,53.34 83.82,57.15 71.75,4.45 47.31,46.67 55.56,13.97 52.7,13.97 63.5,18.41 65.72,20 68.9,21.91 67.31,12.7 39.37,22.54 73.66,55.24 43.18,41.91 40.01,41.91 40.01,40.64 40.01,39.37 40.01,38.1 53.34,43.18 43.18,39.37 43.18,40.64 34.92,38.1 34.92,39.37 34.92,40.64 34.92,41.91 53.34,44.45 53.34,45.72 53.34,46.99 40.01,16.51 35.24,26.35 35.24,19.37 35.24,22.54 32.07,26.35 32.07,22.54 32.07,24.45 35.24,24.45 31.11,19.68 44.13,19.05 82.55,22.86 88.9,22.86 88.9,15.88 90.81,50.8 84.45,41.91 84.45,40.64 92.08,40.64 92.08,33.02 92.08,26.67 92.08,22.86 92.08,36.83 82.55,21.59 82.55,24.13 87.63,31.75 85.72,37.47 57.15,44.45 57.15,45.72 57.47,37.15 64.14,37.47 64.14,38.73 64.14,40.01 60.33,40.01 60.33,38.73 60.33,37.47 56.52,40.01 54.29,40.01 24.77,48.9 24.77,42.55 27.3,42.55 27.3,48.9 22.23,50.16 22.23,45.09 20.32,19.68 20.32,22.23 19.68,26.04 15.88,22.23 12.06,25.4 22.23,28.57 19.68,31.11 8.26,46.35 11.43,41.91 10.16,38.1 8.89,38.1 7.62,38.1 9.53,24.77 29.21,22.23 26.67,22.23 24.77,19.68 27.94,19.68 33.02,12.06 31.75,12.06 30.48,12.06 59.05,25.4 55.24,27.3 60.33,27.94 57.78,26.67 73.66,21.59 83.82,14.61 40.01,12.7 44.13,12.7 63.5,45.72 84.14,2.22 84.14,6.99 82.87,10.79 83.5,12.06 74.93,53.34 81.28,51.44 83.19,51.44 78.74,57.78 69.22,50.16 67.31,50.16 67.31,53.34 73.66,53.34 73.03,14.92 71.75,1.27 70.48,1.27 70.48,4.45 90.81,52.07 93.98,48.9 95.25,48.9 73.66,57.15 62.87,50.16 64.14,51.44 65.41,52.7 64.14,46.99 65.41,48.26 47.31,47.94 53.34,48.26 53.34,49.53 53.34,50.8 57.15,43.18 27.94,16.51 40.01,17.78 40.01,19.05 44.13,20.32 44.13,17.78 44.13,16.51 44.13,11.43 34.92,16.51 36.51,53.66 60.33,41.27 64.14,41.27
  pour Top (isolate 0.305): -1.27,64.77 101.6,64.77 101.6,-0.64 -1.27,-0.64
  pour Bottom (isolate 0.305): -1.27,64.77 101.6,64.77 101.6,-0.64 -1.27,-0.64
LCD_SCLK
  Top 0.254: IC2.53 51.28,55.73 SV2.8
LCD_SDAT
  Top 0.254: IC2.51 52.28,51.65 SV2.6
MISO  (via drill 0.5)
  Top 0.254: 49.21,9.84 SV3.13 47.94,11.11 47.94,13.34 | IC2.22 48.28,23.83 47.31,22.86 47.31,16.51 47.94,15.88 47.94,13.34 | v47.62,13.34 47.94,13.34
  Bottom 0.254: SV1.7 6.99,18.41 6.99,16.51 9.53,13.97 46.99,13.97 v47.62,13.34
MOSI  (via drill 0.5)
  Top 0.254: IC2.23 48.78,23.38 47.94,22.54 47.94,17.14 v48.26,16.83 48.58,16.51 48.58,11.75 50.8,9.53 52.07,9.53 SV3.14
  Bottom 0.254: SV1.6 8.26,16.51 10.16,14.61 47.31,14.61 48.26,15.56 v48.26,16.83
N$4
  Top 0.254: IC2.4 34.29,34.63 arc-54 32.38,35.56 arc53 31.11,36.2 29.84,36.2 arc-19 Z1.1
  Bottom 0.254: C3.2 26.04,34.42 R3.1 26.04,35.43 Z1.1
N$5
  Top 0.254: IC2.3 34.61,35.13 arc-56 33.02,35.88 arc53 31.11,36.83 29.84,36.83 arc-37 27.94,37.47 arc37 26.04,38.1 arc53 Z1.2
  Bottom 0.254: C2.2 23.5,34.42 R3.2 23.5,35.43 Z1.2
N$7
  Top 0.254: L2.2 40.96,27.11 C8.1 40.77,28.7 42.2,30.14 IC2.13
N$10
  Top 0.61: DA1.20 71.69,26.16 C15.2 68.39,26.16 L4.1
N$11
  Top 0.61: DA1.3 74.3,14.61 75.56,13.34 85.09,13.34 87.38,15.62 L6.1
N$12
  Top 0.61: DA1.8 80.64,19.68 81.28,20.32 85.09,20.32 85.72,20.95 L8.1
N$13
  Top 0.61: DA1.13 80.64,28.89 81.28,29.53 83.5,29.53 87.38,25.65 L10.1
N$14
  Top 0.61: DA1.18 74.3,30.48 74.93,31.11 83.82,31.11 86.36,28.57 L12.1
N$15
  Top 0.61: C17.2 71.69,45.85 DA2.20 L5.1
N$16
  Top 0.254: C4.2 31.05,34.73 Z2.2 arc23 34.32,34.13 IC2.5
  Bottom 0.254: Z2.2 R4.2
N$17
  Top 0.61: DA2.3 74.3,33.02 74.93,32.38 86.11,32.38 87.38,33.66 L7.1
N$18
  Top 0.61: DA2.8 80.64,38.1 81.28,38.73 L9.1
N$19
  Top 0.61: DA2.13 80.64,44.45 81.28,43.81 84.45,43.81 86.36,41.91 L11.1
N$20
  Top 0.61: DA2.18 74.3,49.53 74.93,50.16 86.36,50.16 87.38,49.15 L13.1
N$21
  Top 0.254: LED1.C R9.2
N$22
  Top 0.254: L3.2 39.37,27.18 | 39.37,27.18 C8.2 | 39.37,27.18 39.37,28.26 41.75,30.64 IC2.12
N$23
  Top 0.254: L1.1 50.16,16.51 | 50.16,16.51 IC3.3 | C6.1 49.53,15.88 50.16,16.51
N$24  (via drill 3.2 pad 5)
  other vias: 5,10
N$25  (via drill 3.2 pad 5)
  other vias: 87,10
N$26  (via drill 3.2 pad 5)
  other vias: 5,54
N$27  (via drill 3.2 pad 5)
  other vias: 87,54
N$28
  Top 0.813: C19.1 95.22,17.78 X1.1
  Bottom 0.813: C19.1 95.22,17.78 X1.1
N$29
  Top 0.813: C21.2 94.95,20.95 X1.2
  Bottom 0.813: C21.2 94.95,20.95 X1.2
N$30
  Top 0.813: C23.1 95.23,24.77 X1.3
  Bottom 0.813: C23.1 95.23,24.77 X1.3
N$31
  Top 0.813: C25.2 94.92,28.57 X1.4
  Bottom 0.813: C25.2 94.92,28.57 X1.4
N$32
  Top 0.61: C20.1 95.56,34.92 X1.6
  Bottom 0.61: C20.1 95.56,34.92 X1.6
N$33
  Top 0.61: C22.2 95.87,38.73 X1.7
  Bottom 0.61: C22.2 95.87,38.73 X1.7
N$34
  Top 0.61: C24.1 95.55,41.91 X1.8
  Bottom 0.61: C24.1 95.55,41.91 X1.8
N$35
  Top 0.61: C26.2 95.86,45.72 X1.9
  Bottom 0.61: C26.2 95.86,45.72 X1.9
N$36
  Top 0.254: Q1.2 79.69,8.89 80.33,9.53 82.23,9.53 82.68,9.08 R14.2
N$37
  Top 0.254: Q1.1 77.75,7.11 R10.1 R13.2 Q2.3
N$38
  Top 0.254: R11.1 75.71,11.11 Q2.1 75.56,12.07 74.93,12.7 70.67,12.7 R12.2
N$39
  Top 0.254: R17.2 83.5,5.4 84.14,4.76 87.31,4.76 90.17,7.62 USB1.D+
N$40
  Top 0.254: R18.2 83.5,3.81 83.82,4.13 87.63,4.13 90.32,6.82 USB1.D-
N$41
  Top 0.61: D1.C 18.07,44.21 IC5.1
  Top 1.016: D1.C 18.07,36.53 L14.2
N$42
  Top 0.406: R19.1 R21.2 11.3,49.66 12.06,48.9 IC5.5
N$43
  Top 0.406: R22.2 C35.2
N$44
  Top 0.406: C36.1 C35.1 19.18,49.12 IC5.4
N$45
  Top 0.406: IC5.6 10.79,47.62 TP2.PP
N$46
  Top 0.406: LED2.A R20.1
PB12  (via drill 0.5)
  Top 0.254: IC2.33 58.04,28.64 v60.33,26.35
  Bottom 0.254: v60.33,26.35 60.33,23.5 59.69,22.86 59.69,17.78 60.01,17.46 60.01,16.19 58.42,14.61 58.42,12.06 60.96,9.53 62.23,9.53 SV3.18
PC0
  Top 0.254: IC2.8 39.94,32.63 36.2,28.89 36.2,13.97 33.02,10.79 29.21,10.79 SV3.3
PC1
  Top 0.254: IC2.9 40.39,32.13 36.83,28.57 36.83,13.34 33.66,10.16 31.11,10.16 SV3.4
PC2
  Top 0.254: IC2.10 40.84,31.64 37.47,28.26 37.47,12.7 34.29,9.53 33.02,9.53 SV3.5
PC3
  Top 0.254: IC2.11 41.3,31.14 38.1,27.94 38.1,12.06 SV3.6
PD2
  Top 0.254: IC2.54 50.78,53.99 SV2.9
PWM1  (via drill 0.5)
  Top 0.254: IC2.37 70.33,30.64 v71.12,29.84 | v71.75,20 DA1.1
  Bottom 0.254: v71.75,20 71.75,24.45 68.9,27.3 68.9,28.89 69.53,29.53 70.8,29.53 v71.12,29.84
PWM2  (via drill 0.5)
  Top 0.254: v83.19,28.26 DA1.11 | IC2.38 72.37,31.14 v73.34,31.11
  Bottom 0.254: 83.19,27.94 v83.19,28.26 arc-62 81.6,27.3 arc-90 80.96,27.94 80.96,30.48 80.33,31.11 v73.34,31.11
PWM3  (via drill 0.5)
  Top 0.254: IC2.39 70.05,31.64 v70.48,32.07 | DA2.1 71.25,36.64 v70.48,35.88
  Bottom 0.254: v70.48,32.07 v70.48,35.88
PWM4  (via drill 0.5)
  Top 0.254: IC2.40 68.97,32.13 v69.53,32.7 | v83.19,47.94 DA2.11
  Bottom 0.254: v69.53,32.7 69.53,36.51 78.11,45.09 80.33,45.09 v83.19,47.94
RF_CE  (via drill 0.5)
  Top 0.254: IC2.56 49.78,51.19 46.99,53.98 45.72,53.98 SV2.11 | SV1.3 9.53,18.41 9.53,15.24 10.16,14.61 28.89,14.61 33.66,19.37 33.66,26.67 arc-62 v35.56,29.84
  Bottom 0.254: v35.56,29.84 36.83,31.11 36.83,48.9 SV2.11
SCL2  (via drill 0.5)
  Top 0.254: R2.1 62.87,16.51 62.23,17.14 IC1.6 60.01,17.14 arc37 v59.05,16.83 arc-54 56.47,15.51 IC3.6 | IC2.29 51.78,24.42 52.7,23.5 57.15,23.5 v57.78,24.13
  Bottom 0.254: SV3.17 57.78,11.43 57.78,14.92 59.05,16.19 v59.05,16.83 59.05,22.86 v57.78,24.13
SCLK  (via drill 0.5)
  Top 0.254: 47.78,8.73 SV3.12 46.67,9.84 46.67,15.56 | IC2.21 47.78,24.29 46.67,23.18 46.67,15.56 | v46.99,15.56 46.67,15.56
  Bottom 0.254: SV1.5 9.53,18.41 9.53,16.51 10.79,15.24 46.67,15.24 v46.99,15.56
SDA2  (via drill 0.5)
  Top 0.254: R1.1 64.45,13.65 63.5,14.61 63.5,17.14 62.23,18.41 IC1.5 60.01,18.41 arc53 v58.1,17.46 arc-90 56.65,16.01 IC3.7 | IC2.30 52.28,25.19 53.34,24.13 56.52,24.13 v56.83,24.45
  Bottom 0.254: SV3.16 59.05,8.89 57.15,10.79 57.15,15.24 58.1,16.19 v58.1,17.46 58.42,17.78 58.42,22.23 56.83,23.81 v56.83,24.45
SENS1
  Top 0.254: IC2.14 42.65,29.64 41.91,28.89 41.91,12.06 39.37,9.53 38.1,9.53 SV3.7
SENS2
  Top 0.254: IC2.15 43.1,29.14 42.55,28.57 42.55,11.43 SV3.8
SENS3
  Top 0.254: IC2.16 43.83,28.59 43.18,27.94 43.18,9.53 SV3.9
SENS4
  Top 0.254: IC2.17 45.78,26.09 45.4,25.72 45.4,9.21 SV3.10
SERVO1
  Top 0.254: IC2.58 48.78,49.65 45.72,52.7 41.91,52.7 SV2.13
SERVO2
  Top 0.254: IC2.59 48.28,48.88 45.09,52.07 40.01,52.07 SV2.14
SERVO3
  Top 0.254: IC2.61 47.28,42.26 46.35,43.18 46.35,48.26 45.72,48.9 41.27,48.9 37.47,52.7 36.83,52.7 arc-90 SV2.15
SERVO4
  Top 0.254: IC2.62 46.78,41.8 45.72,42.86 45.72,47.62 45.09,48.26 40.64,48.26 36.83,52.07 36.2,52.07 arc-74 SV2.16
SWCLK
  Top 0.254: IC2.49 57.45,38.09 58.1,38.73 58.1,43.81 60.33,46.04 60.33,59.69 60.96,60.33 79.38,60.33 JP1.3
SWDIO
  Top 0.254: IC2.46 57.04,35.13 58.74,36.83 58.74,43.5 60.96,45.72 60.96,52.7 62.87,54.61 62.87,59.05 63.5,59.69 80.64,59.69 83.19,62.23 JP1.2
TAMPER
  Top 0.254: IC2.2 41.84,35.63 41.27,36.2 41.27,42.55 40.32,43.5 40.32,47.31 36.2,51.44 35.56,51.44 arc-65 SV2.17
USB_DISC
  Top 0.254: IC2.25 49.78,21.98 50.8,20.95 67.94,20.95 arc-77 69.53,19.68 R12.1
USB_DM  (via drill 0.5)
  Top 0.254: v79.38,4.13 79.69,3.81 R18.1 C27.1 | v64.14,34.61 63.82,34.61 63.34,34.13 IC2.44
  Bottom 0.254: v64.14,34.61 64.45,34.29 64.45,22.54 70.48,16.51 70.48,12.06 78.42,4.13 v79.38,4.13
USB_DP  (via drill 0.5)
  Top 0.254: R17.1 C28.1 R14.1 | R17.1 80.96,5.59 | IC2.45 62.58,34.63 63.5,35.56 64.77,35.56 v65.09,35.24 | v79.38,5.4 R17.1
  Bottom 0.254: v65.09,35.24 65.09,22.86 71.12,16.83 71.12,12.38 78.11,5.4 v79.38,5.4
USB_P  (via drill 0.5)
  Top 0.254: v64.14,20 63.82,20.32 50.16,20.32 49.28,21.2 IC2.24 | R15.2 R16.2 73.79,2.1 73.03,2.86 v73.03,4.45
  Bottom 0.254: v64.14,20 64.45,20 68.58,15.88 68.58,12.06 73.03,7.62 v73.03,4.45
VBAT
  Top 0.254: IC2.1 42.6,36.13 41.91,36.83 41.91,45.88 G1.+
VBUS
  Top 0.254: USB1.VBUS 90.47,6.02 TP1.PP 85.72,2.54 84.45,1.27 80.01,1.27 77.66,3.62 R15.1 R10.2
VDD  (via drill 0.5, 0.7, 0.8)
  Top 0.61: DA2.10 84.01,36.64 v84.77,35.88 85.22,35.43 C18.1 | DA1.10 83.19,18.41 83.5,18.73 84.52,18.73 v84.64,18.86 85.09,18.41 C16.1 | v10.16,45.09 IC5.8
  Top 0.813: v61.91,27.94 62.23,27.62 L4.2 | v67.63,51.75 69.79,51.75 70.36,51.69 L5.2 72.64,51.69 | SV2.1 SV2.2
  Top 1.016: SV2.1 70.48,55.88 71.75,54.61 L5.2 | 72.64,51.69 77.09,51.69 78.11,51.75 C32.+ 80.01,52.07 81.92,53.98 81.92,57.15 83.44,58.67 C33.1 89.53,57.78 93.98,53.34 96.48,53.34 X2.1
  Bottom 0.61: v84.77,35.88 84.77,33.97 85.41,33.34 85.41,19.62 v84.64,18.86
  Bottom 0.813: v67.63,51.75 66.36,51.75 61.91,46.99 v61.91,27.94
  Bottom 1.016: v84.77,35.88 81.92,38.73 81.92,43.18 87.63,48.9 91.4,48.9 X2.1
  Bottom 1.27: v10.16,45.09 10.16,59.69 12.06,61.59 71.75,61.59 76.2,57.15 76.2,54.61 C32.+
XTAL2
  Top 0.254: C5.2 31.05,30.04 Z2.1 arc-99 34.27,33.63 IC2.6
  Bottom 0.254: Z2.1 R4.1

### Text on the board
tPlace: tuxotronic.org | RoboCart 4x4 | Rev.A (11.11.2012) | Ord. #63565
tNames: GND | GND | !RST | SWC | SWD | 3V3 | GND | +5V | +3.3V | PC13 | SERVO4 | SERVO3 | SERVO2 | SERVO1 | PB5 | PB4 | PB3 | PD2 | U3_CK | U3_RX | U3_TX | !RESET | GND | GND | +BAT | +BAT | +6V | Mount 82x44mm | GND | +3.3V | PC0 | PC1 | PC2 | PC4 | SENS1 | SENS2 | SENS3 | SENS4 | !CS | SCLK | MISO | MOSI | GND | SDA | SCL | PB12 | +3.3V | GND
bNames: B4 | A4 | B3 | A3 | GND | B2 | A2 | GND | MISO | SCLK | !RF_CE | GND | B1 | A1 | IRQ | MOSI | !RF_CS | VCC